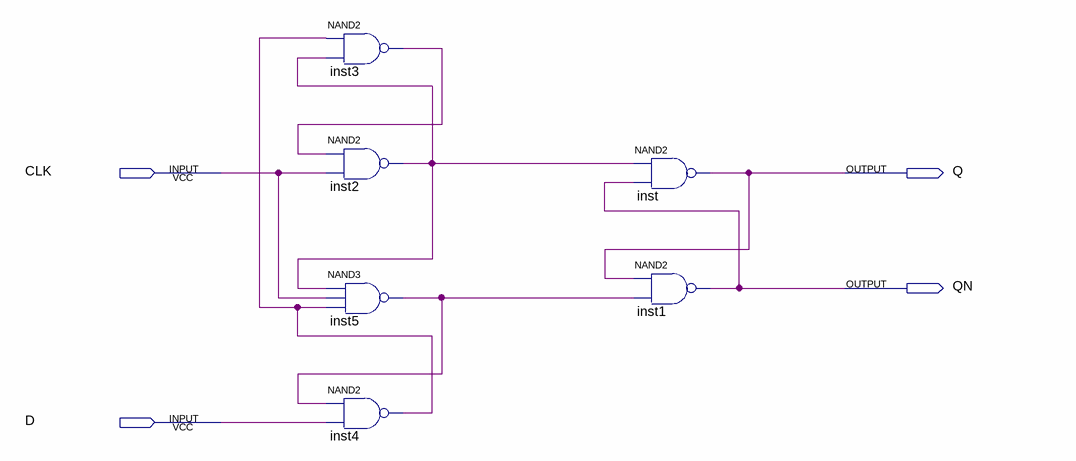
[diagram p0: schematic sheet]
// Quartus schematic lab9step3b.bdf as structural Verilog: 6 symbols, 4 pins
module lab9step3b (
  input  CLK,
  input  D,
  output Q,
  output QN
);

  wire inst2_out, inst3_out, inst4_out, inst5_out;

  nand inst3 (inst3_out, inst4_out, inst2_out);
  nand inst2 (inst2_out, inst3_out, CLK);
  nand inst5 (inst5_out, inst2_out, CLK, inst4_out);
  nand inst4 (inst4_out, inst5_out, D);
  nand inst (Q, inst2_out, QN);
  nand inst1 (QN, Q, inst5_out);
endmodule
